# EAGLE design RS232_NPN_PNP_FTDI_2 (EAGLE 7.6.0)
RS232 Adapter using NPN and PNP Transistors
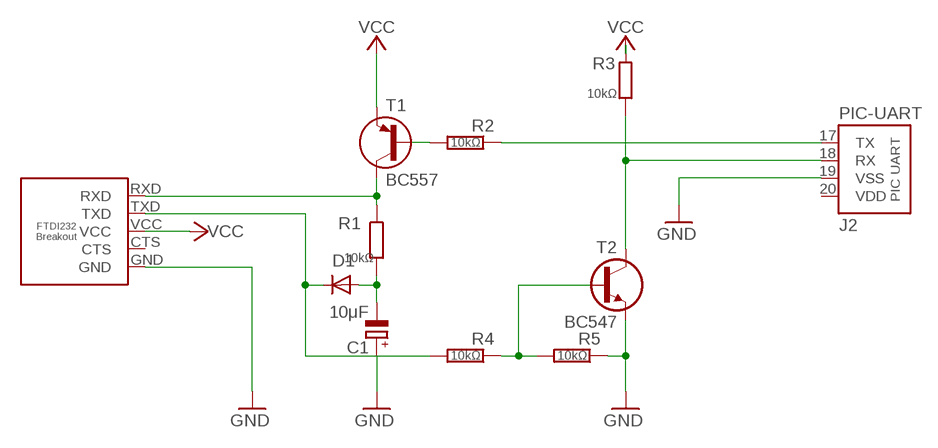
[diagram p0: schematic, sheet 1]

## Parts
C1  10μF  CPOLE2,5-4/V  [E2.5-4/V]
D1  1N4148  1N414834-5V  [DO34-5V]
J1  FTDI232-BO-5P-L  [FTDI232-BO-5-L]
J2  PIC-UART  [PIC-UART]
R1  10kΩ  R0202/7-V  [0202/7-V]
R2  10kΩ  R0202/5  [0202/5]
R3  10kΩ  R0202/5  [0202/5]
R4  10kΩ  R0202/5  [0202/5]
R5  10kΩ  R0202/5  [0202/5]
T1  BC557  BC557CBE  [TO92-CBE]
T2  BC547  BC547CBE  [TO92-CBE]

## Nets
-12V: C1.- D1.A R1.2
GND: C1.+ J1.GND J2.19(VSS) R5.1 T2.E
N$1: R2.2 T1.B
N$6: R4.1 R5.2 T2.B
RX: J2.18(RX) R3.1 T2.C
RXD: J1.RXD R1.1 T1.C
TX: J2.17(TX) R2.1
TXD: D1.C J1.TXD R4.2
VCC: J1.VCC R3.2 T1.E
Unconnected: J1.CTS J2.20(VDD)

## Library data of the parts
C1 = c:CPOL: POLARIZED CAPACITOR, European symbol
D1 = d:1N4148
J1 = pinconn:FTDI232-BO-5P
J2 = pinconn:PIC-UART
R1-R5 = r:R: RESISTOR, European symbol
T1 = t:BC557
T2 = t:BC547

## Net classes
0 default: width 0.61 mm

## Board
RS232 Adapter using NPN and PNP Transistors
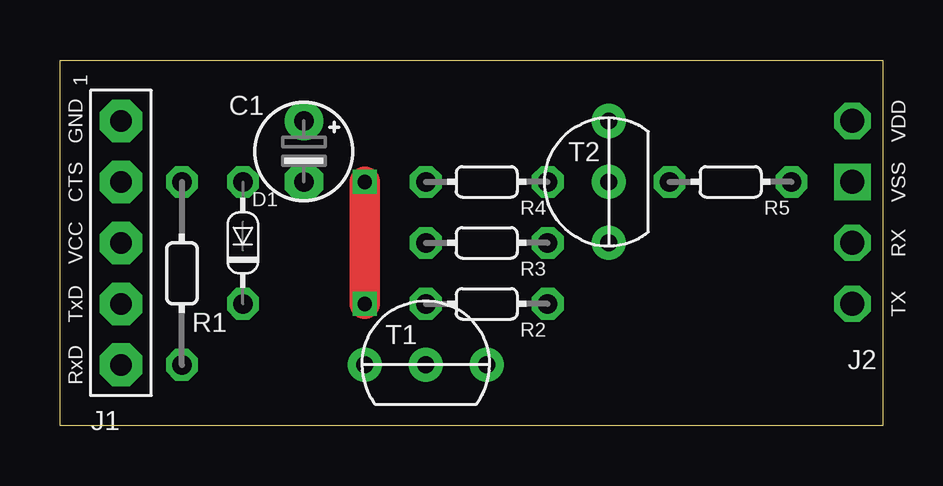
[diagram p1: board, top side]
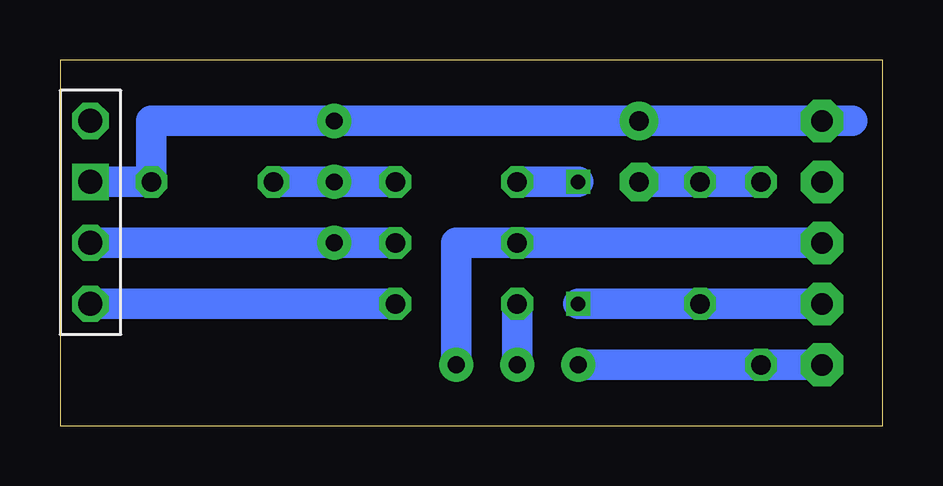
[diagram p2: board, bottom side, seen from below]

Size 34.29 x 15.24 mm. Coordinates in mm from the lower left corner, seen from the top.
Outline: 0,15.24 34.29,15.24 34.29,0 0,0 0,15.24
Copper layers (1*16): Top 0.035mm / dielectric 1.5mm / Bottom 0.035mm
Design rules "default": minimum track width 10mil, minimum drill 24mil, track to track 8mil, track to pad 8mil, pad to pad 8mil, via to via 8mil, smd to smd 8mil, copper to edge 40mil, drill to drill 8mil, minimum pad ring 10mil, minimum via ring 8mil, stop-mask expansion 4mil, vias tented up to drill 0mil, thermal gap 10mil

### Footprints (pad centres in the part's own frame; a part is rotated, then mirrored left to right if it is on the bottom)
E2.5-4/V = drill 0.813 pad 1.6: + 0,2.54 | drill 0.813 pad 1.6 octagon: - 0,0
DO34-5V = drill 0.813 octagon: A 0,2.54; C 0,-2.54
FTDI232-BO-5-L = drill 0.9 pad 1.778 octagon: CTS 0,2.54; GND 0,5.08; RXD 0,-5.08; TXD 0,-2.54; VCC 0,0
PIC-UART = drill 1 octagon: 17 0,0; 18 0,2.54; 20 0,7.62 | drill 1 square: 19 0,5.08
0202/7-V = drill 0.813 octagon: 1 0,-3.81; 2 0,3.81
0202/5 = drill 0.813 octagon: 1 -2.54,0; 2 2.54,0
TO92-CBE = drill 0.7 pad 1.422: B 0,0; C 0,2.54; E 0,-2.54

### Placement (x,y rotation side)
C1  10.16,10.16 0 top
D1  7.62,7.62 0 top
J1  2.54,7.62 0 top
J2  33.02,5.08 0 top
R1  5.08,6.35 0 top
R2  17.78,5.08 180 top
R3  17.78,7.62 180 top
R4  17.78,10.16 180 top
R5  27.94,10.16 180 top
T1  15.24,2.54 90 top
T2  22.86,10.16 180 top

### Tracks (layer width: path | path; a pad name or v marks a point on that pad's centre or on a via)
-12V
  Bottom 1.27: R1.2 C1.-
GND
  Bottom 1.27: J2.19 R5.1 30.48,12.7 T2.E C1.+ J1.GND 1.27,12.7
N$1
  Bottom 1.27: T1.B R2.2
N$6
  Bottom 1.27: R5.2 T2.B R4.1
RX
  Bottom 1.27: J2.18 T2.C R3.1
RXD
  Bottom 1.27: R1.1 T1.C J1.RXD
TX
  Bottom 1.27: J2.17 R2.1
TXD  (via drill 0.6)
  Top 1.27: v12.7,10.16 v12.7,5.08
  Bottom 1.27: J1.TXD D1.C v12.7,5.08 | R4.2 v12.7,10.16
VCC
  Bottom 1.27: J1.VCC R3.2 17.78,7.62 T1.E